# Altium schematic sheet PCB.SchDoc
size A4
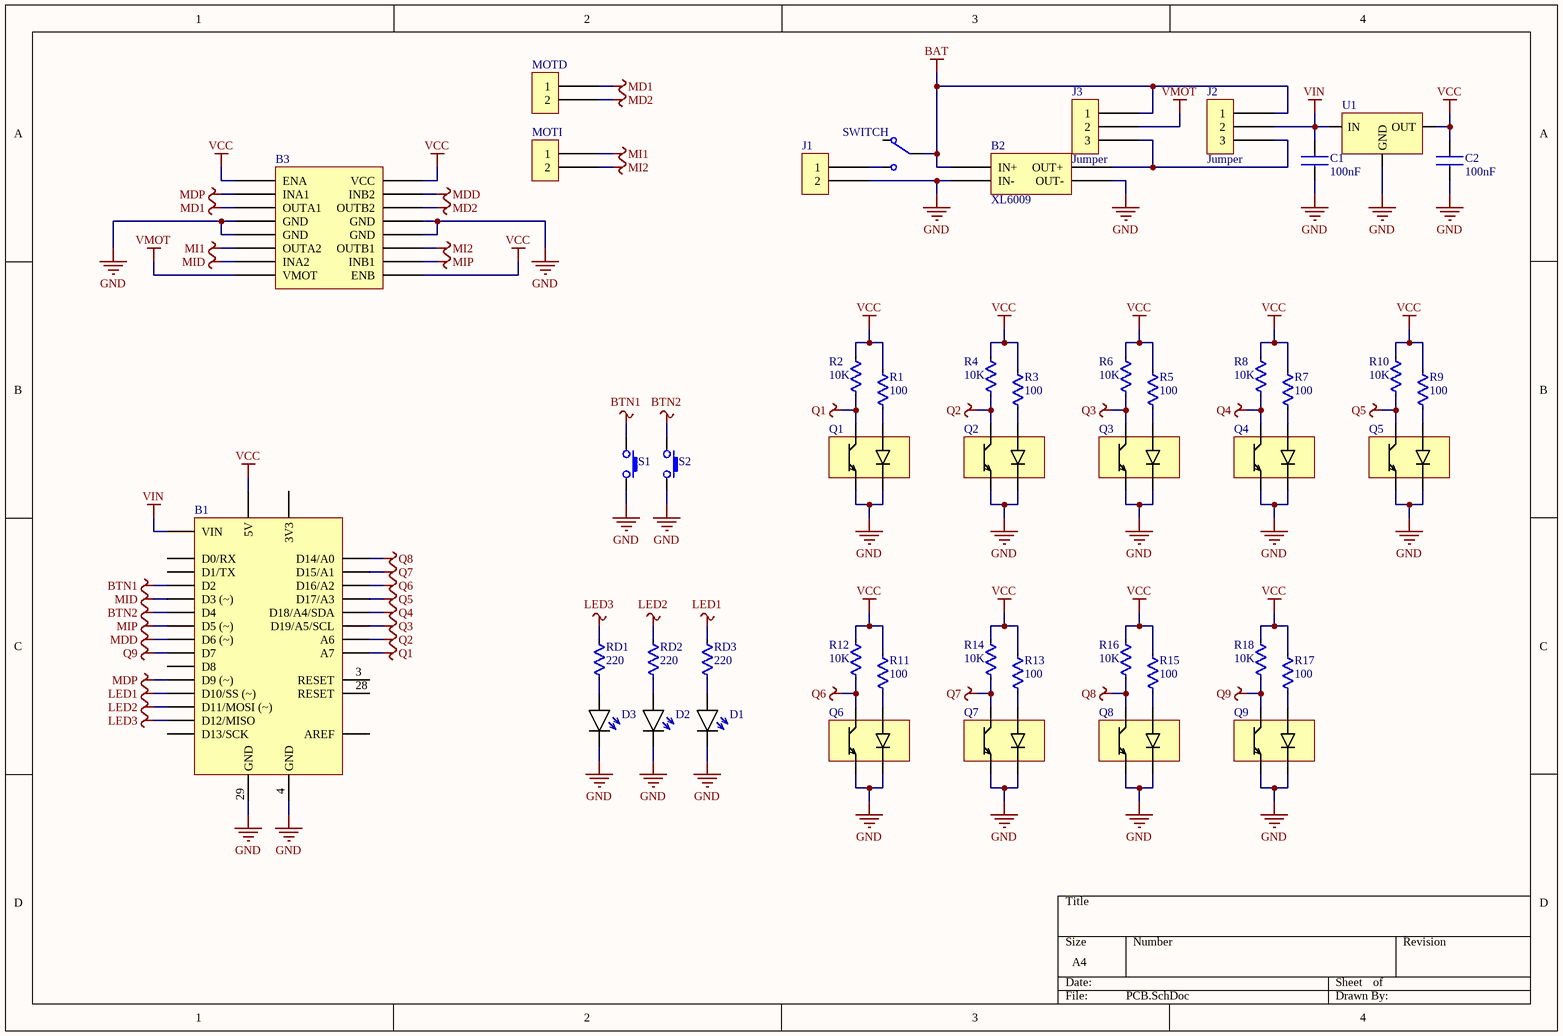
[diagram p0: PCB.SchDoc]

## Parts
B1  ARDUINO NANO  [ARDUINO NANO]  (value not drawn)
B2  XL6009  [XL6009 mdl]
B3  L293D  [DIP16]  (value not drawn)
C1  value 100nF  [CAP-CER]  (hidden comment: CAP-CER)
C2  value 100nF  [CAP-CER]  (hidden comment: CAP-CER)
D1  LED  [LED-3MM-GREEN]  (value not drawn)
D2  LED  [LED-3MM-YELLOW]  (value not drawn)
D3  LED  [LED-3MM-RED]  (value not drawn)
J1  Header 1x2  [HEADER 1x2]  (value not drawn)
J2  Jumper  [Header 1x3]
J3  Jumper  [Header 1x3]
MOTD  Header 1x2  [HEADER 1x2]  (value not drawn)
MOTI  Header 1x2  [HEADER 1x2]  (value not drawn)
Q1  QRE1113GR  [QRE1113GR]  (value not drawn)
Q2  QRE1113GR  [QRE1113GR]  (value not drawn)
Q3  QRE1113GR  [QRE1113GR]  (value not drawn)
Q4  QRE1113GR  [QRE1113GR]  (value not drawn)
Q5  QRE1113GR  [QRE1113GR]  (value not drawn)
Q6  QRE1113GR  [QRE1113GR]  (value not drawn)
Q7  QRE1113GR  [QRE1113GR]  (value not drawn)
Q8  QRE1113GR  [QRE1113GR]  (value not drawn)
Q9  QRE1113GR  [QRE1113GR]  (value not drawn)
R1  value 100  [RES-Axial-400mil]  (hidden comment: RES)
R2  value 10K  [RES-Axial-400mil]  (hidden comment: RES)
R3  value 100  [RES-Axial-400mil]  (hidden comment: RES)
R4  value 10K  [RES-Axial-400mil]  (hidden comment: RES)
R5  value 100  [RES-Axial-400mil]  (hidden comment: RES)
R6  value 10K  [RES-Axial-400mil]  (hidden comment: RES)
R7  value 100  [RES-Axial-400mil]  (hidden comment: RES)
R8  value 10K  [RES-Axial-400mil]  (hidden comment: RES)
R9  value 100  [RES-Axial-400mil]  (hidden comment: RES)
R10  value 10K  [RES-Axial-400mil]  (hidden comment: RES)
R11  value 100  [RES-Axial-400mil]  (hidden comment: RES)
R12  value 10K  [RES-Axial-400mil]  (hidden comment: RES)
R13  value 100  [RES-Axial-400mil]  (hidden comment: RES)
R14  value 10K  [RES-Axial-400mil]  (hidden comment: RES)
R15  value 100  [RES-Axial-400mil]  (hidden comment: RES)
R16  value 10K  [RES-Axial-400mil]  (hidden comment: RES)
R17  value 100  [RES-Axial-400mil]  (hidden comment: RES)
R18  value 10K  [RES-Axial-400mil]  (hidden comment: RES)
RD1  value 220  [RES-RADIAL]  (hidden comment: RES)
RD2  value 220  [RES-RADIAL]  (hidden comment: RES)
RD3  value 220  [RES-RADIAL]  (hidden comment: RES)
S1  BUTTON_SMALL_4PIN  [TACT_SWITCH-SMALL-4PIN]  (value not drawn)
S2  BUTTON_SMALL_4PIN  [TACT_SWITCH-SMALL-4PIN]  (value not drawn)
SWITCH  SLIDE-SWITCH  [SWITCH]  (value not drawn)
U1  LM7805  [TO-220-STRAIGHT]  (value not drawn)

## Nets
BAT: B2.0(IN+) J2.1 J3.1 SWITCH.2
BTN1: B1.5(D2) S1.1
BTN2: B1.7(D4) S2.1
GND: B1.4(GND) B1.29(GND) B2.1(IN-) B2.2(OUT-) B3.4(GND) B3.5(GND) B3.12(GND) B3.13(GND) C1.1 C2.1 D1.K D2.K D3.K J1.2 Q1.E Q1.K Q2.E Q2.K Q3.E Q3.K Q4.E Q4.K Q5.E Q5.K Q6.E Q6.K Q7.E Q7.K Q8.E Q8.K Q9.E Q9.K S1.2 S2.2 U1.2(GND)
LED1: B1.13(D10/SS_(~)) RD3.1
LED2: B1.14(D11/MOSI_(~)) RD2.1
LED3: B1.15(D12/MISO) RD1.1
MD1: B3.3(OUTA1) MOTD.1
MD2: B3.14(OUTB2) MOTD.2
MDD: B1.9(D6_(~)) B3.15(INB2)
MDP: B1.12(D9_(~)) B3.2(INA1)
MI1: B3.6(OUTA2) MOTI.1
MI2: B3.11(OUTB1) MOTI.2
MID: B1.6(D3_(~)) B3.7(INA2)
MIP: B1.8(D5_(~)) B3.10(INB1)
Q1: B1.26(A7) Q1.C R2.1
Q2: B1.25(A6) Q2.C R4.1
Q3: B1.24(D19/A5/SCL) Q3.C R6.1
Q4: B1.23(D18/A4/SDA) Q4.C R8.1
Q5: B1.22(D17/A3) Q5.C R10.1
Q6: B1.21(D16/A2) Q6.C R12.1
Q7: B1.20(D15/A1) Q7.C R14.1
Q8: B1.19(D14/A0) Q8.C R16.1
Q9: B1.10(D7) Q9.C R18.1
VCC: B1.27(5V) B3.1(ENA) B3.9(ENB) B3.16(VCC) C2.2 R1.2 R2.2 R3.2 R4.2 R5.2 R6.2 R7.2 R8.2 R9.2 R10.2 R11.2 R12.2 R13.2 R14.2 R15.2 R16.2 R17.2 R18.2 U1.3(OUT)
VIN: B1.30(VIN) C1.2 J2.2 U1.1(IN)
VMOT: B3.8(VMOT) J3.2
NetB2_3: B2.3(OUT+) J2.3 J3.3
NetD1_A: D1.A RD3.2
NetD2_A: D2.A RD2.2
NetD3_A: D3.A RD1.2
NetJ1_1: J1.1 SWITCH.3
NetQ1_A: Q1.A R1.1
NetQ2_A: Q2.A R3.1
NetQ3_A: Q3.A R5.1
NetQ4_A: Q4.A R7.1
NetQ5_A: Q5.A R9.1
NetQ6_A: Q6.A R11.1
NetQ7_A: Q7.A R13.1
NetQ8_A: Q8.A R15.1
NetQ9_A: Q9.A R17.1

Not connected (* = marked no-connect by the designer): B1 1(D1/TX) 2(D0/RX) 3(RESET) 11(D8) 16(D13/SCK) 17(3V3) 18(AREF) 28(RESET); SWITCH 1

## Library data of the parts
B1 = ARDUINO NANO: Allied_Number: 70518857; Geometry.Height: 7.62mm; Manufacturer_Name: Arduino; Manufacturer_Part_Number: Nano; RS Part Number: 6961667; RS Price/Stock: http://uk.rs-online.com/web/p/products/6961667; Allied Price/Stock: http://www.alliedelec.com/arduino-a000005/70518857/; Arrow Part Number: Nano; Arrow Price/Stock: http://uk.rs-online.com/web/p/products/6961667; Datasheet Link: http://docs-europe.electrocomponents.com/webdocs/0db9/0900766b80db99cb.pdf
B2 = XL6009 Module
B3 = L293
J2 J3 = Header 1x3
Q1-Q9 = QRE1113GR: MF: ON Semiconductor; Price: 0.46 USD; MP: QRE1113GR; Package: SMD-4 ON Semiconductor; Availability: Good; Value: *
U1 = LM78XX